# EAGLE schematic sd card copier (EAGLE 8.3.1)
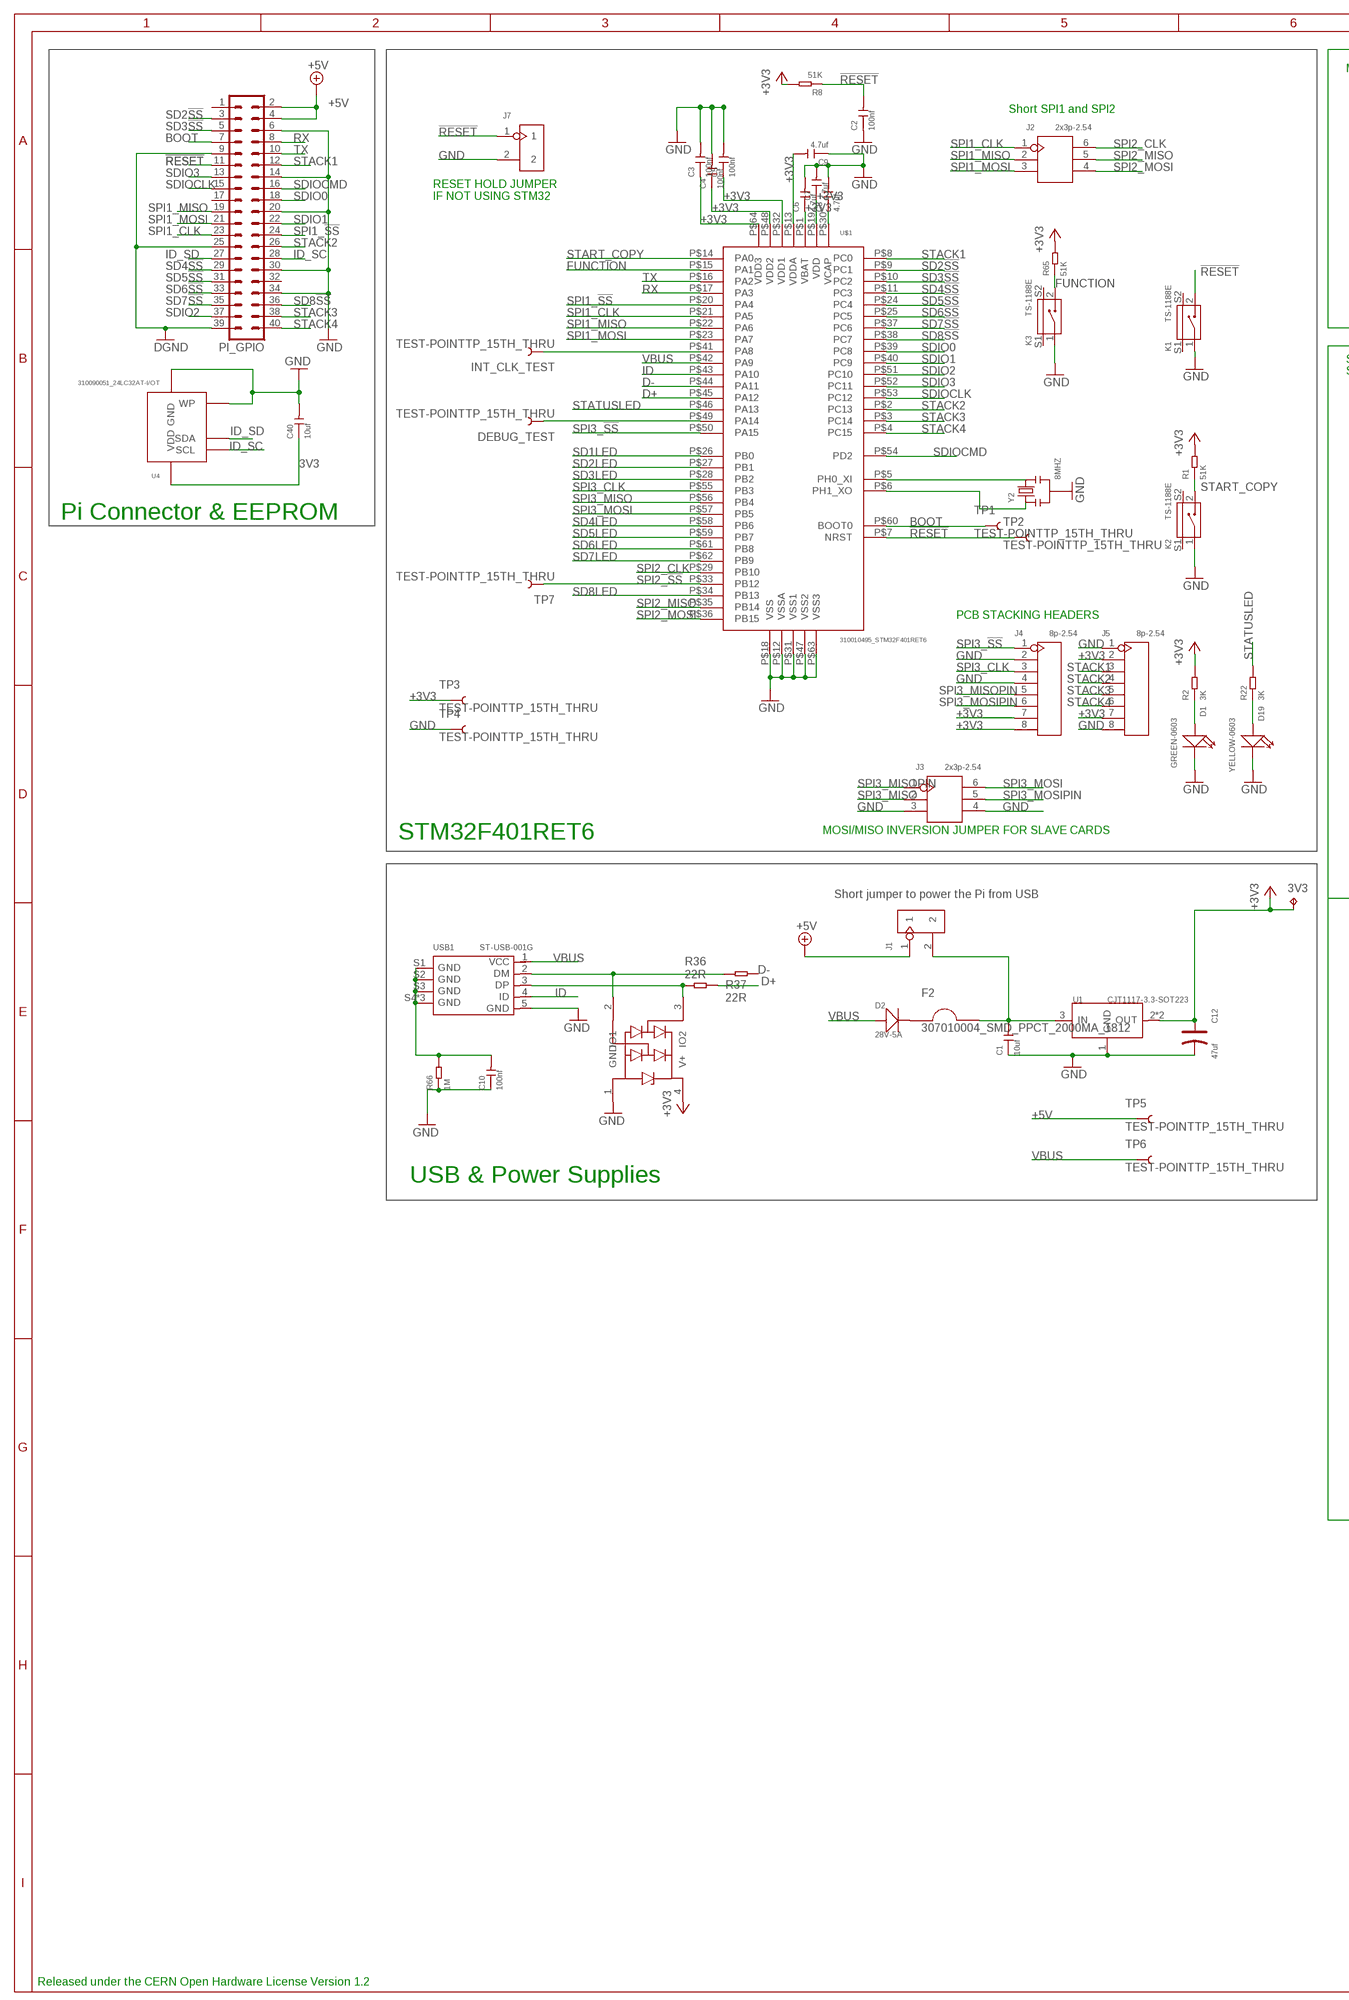
[diagram p0: schematic, sheet 1, part 1 of 2]
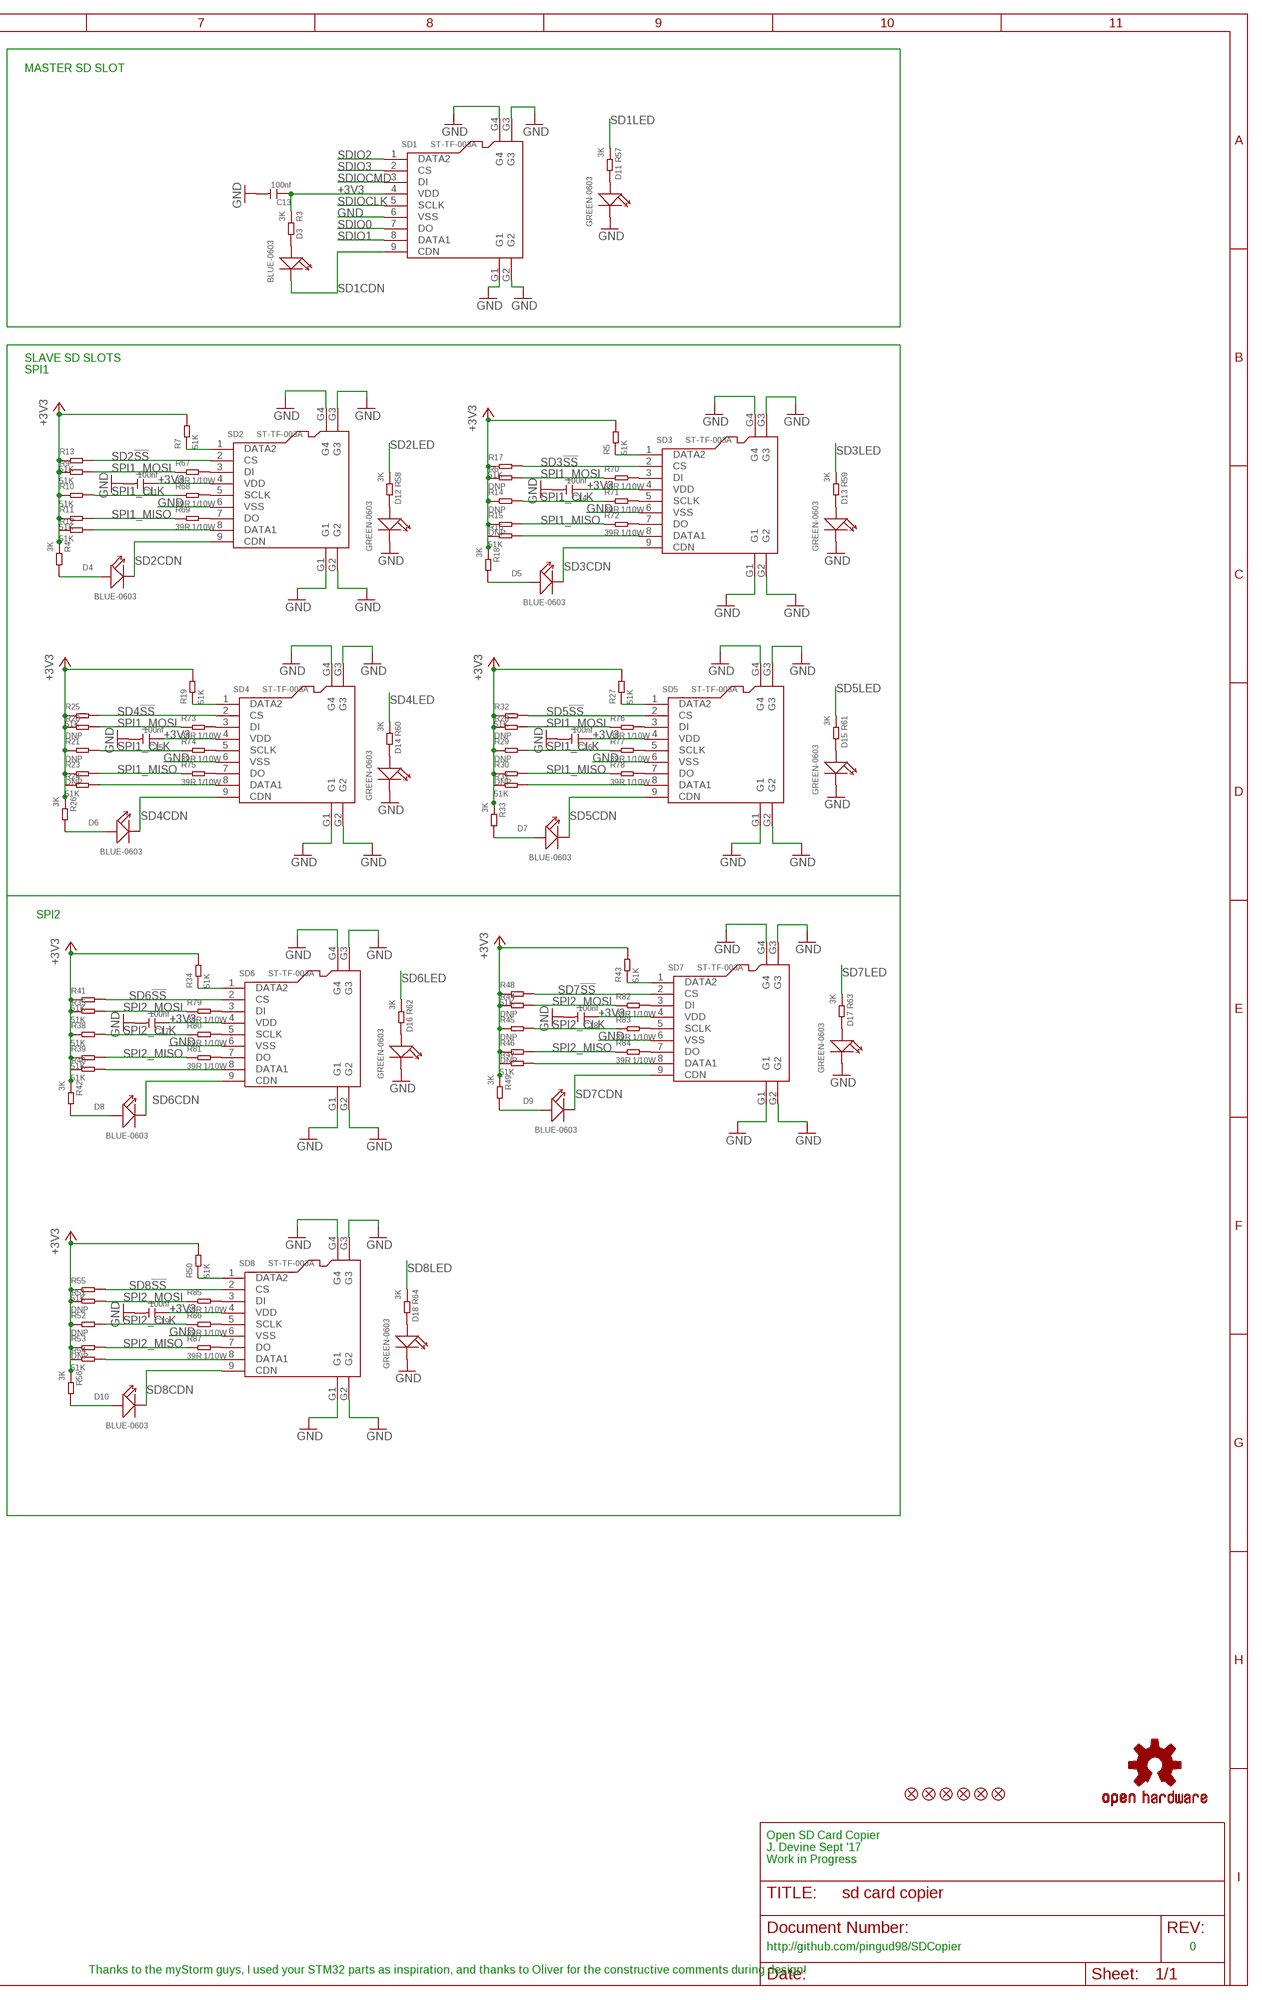
[diagram p1: schematic, sheet 1, part 2 of 2]

## Parts
3V3  TPB1,27  [B1,27]
C1  10uf  CERAMIC-10UF-10V-10%-X5R(0603)  [C0603]
C2  100nf  CERAMIC-100NF-50V-10%-X7R(0603)  [C0603]
C3  100nf  CERAMIC-100NF-50V-10%-X7R(0603)  [C0603]
C4  100nf  CERAMIC-100NF-50V-10%-X7R(0603)  [C0603]
C5  100nf  CERAMIC-100NF-50V-10%-X7R(0603)  [C0603]
C6  4.7uf  CERAMIC-4.7UF-10V-10%-X5R(0603)  [C0603]
C7  4.7uf  CERAMIC-4.7UF-10V-10%-X5R(0603)  [C0603]
C8  4.7uf  CERAMIC-4.7UF-10V-10%-X5R(0603)  [C0603]
C9  4.7uf  CERAMIC-4.7UF-10V-10%-X5R(0603)  [C0603]
C10  100nf  CERAMIC-100NF-50V-10%-X7R(0603)  [C0603]
C11  100nf  CERAMIC-100NF-50V-10%-X7R(0603)  [C0603]
C12  47uf  TANTALUM-SMD-47UF-6.3V(AVX-A)  [AVX-A]
C13  100nf  CERAMIC-100NF-50V-10%-X7R(0603)  [C0603]
C14  100nf  CERAMIC-100NF-50V-10%-X7R(0603)  [C0603]
C15  100nf  CERAMIC-100NF-50V-10%-X7R(0603)  [C0603]
C16  100nf  CERAMIC-100NF-50V-10%-X7R(0603)  [C0603]
C17  100nf  CERAMIC-100NF-50V-10%-X7R(0603)  [C0603]
C18  100nf  CERAMIC-100NF-50V-10%-X7R(0603)  [C0603]
C19  100nf  CERAMIC-100NF-50V-10%-X7R(0603)  [C0603]
C40  10uf  CERAMIC-10UF-10V-10%-X5R(0603)  [C0603]
D1  GREEN-0603  SMD-LED-CLEAR-GREEN(0603)  [LED-0603]
D2  28V-5A  SMD-DIODE-SCHOTTKY-28V-5A(DO-214AA)  [DO-214AA]
D3  BLUE-0603  SMD-LED-CLEAR-BLUE(0603)  [LED-0603]
D4  BLUE-0603  SMD-LED-CLEAR-BLUE(0603)  [LED-0603]
D5  BLUE-0603  SMD-LED-CLEAR-BLUE(0603)  [LED-0603]
D6  BLUE-0603  SMD-LED-CLEAR-BLUE(0603)  [LED-0603]
D7  BLUE-0603  SMD-LED-CLEAR-BLUE(0603)  [LED-0603]
D8  BLUE-0603  SMD-LED-CLEAR-BLUE(0603)  [LED-0603]
D9  BLUE-0603  SMD-LED-CLEAR-BLUE(0603)  [LED-0603]
D10  BLUE-0603  SMD-LED-CLEAR-BLUE(0603)  [LED-0603]
D11  GREEN-0603  SMD-LED-CLEAR-GREEN(0603)  [LED-0603]
D12  GREEN-0603  SMD-LED-CLEAR-GREEN(0603)  [LED-0603]
D13  GREEN-0603  SMD-LED-CLEAR-GREEN(0603)  [LED-0603]
D14  GREEN-0603  SMD-LED-CLEAR-GREEN(0603)  [LED-0603]
D15  GREEN-0603  SMD-LED-CLEAR-GREEN(0603)  [LED-0603]
D16  GREEN-0603  SMD-LED-CLEAR-GREEN(0603)  [LED-0603]
D17  GREEN-0603  SMD-LED-CLEAR-GREEN(0603)  [LED-0603]
D18  GREEN-0603  SMD-LED-CLEAR-GREEN(0603)  [LED-0603]
D19  YELLOW-0603  SMD-LED-CLEAR-YELLOW(0603)  [LED-0603]
DEBUG_TEST  TEST-POINTTP_15TH_THRU  [TP_15TH]
ESD1  PRTR5V0U2X  [SOT143B]
F2  307010004_SMD_PPCT_2000MA_1812  [F1812]
FD1  FIDUCIAL1X2  [FIDUCIAL-1X2]
FD2  FIDUCIAL1X2  [FIDUCIAL-1X2]
FD3  FIDUCIAL1X2  [FIDUCIAL-1X2]
FD4  FIDUCIAL1X2  [FIDUCIAL-1X2]
FD5  FIDUCIAL1X2  [FIDUCIAL-1X2]
FD6  FIDUCIAL1X2  [FIDUCIAL-1X2]
INT_CLK_TEST  TEST-POINTTP_15TH_THRU  [TP_15TH]
J1  DIP-BLACK-JUMPER  [H2-2.54]
J2  2x3p-2.54  DIP-BLACK-MALE-HEADER(2X3P-2.54）-2.54  [H2X3-2.54]
J3  2x3p-2.54  DIP-BLACK-MALE-HEADER(2X3P-2.54）-2.54  [H2X3-2.54]
J4  8p-2.54  DIP-LONG-BLACK-FEMALE-HEADER-VERT(8P-2.54)  [H8-2.54]
J5  8p-2.54  DIP-LONG-BLACK-FEMALE-HEADER-VERT(8P-2.54)  [H8-2.54]
J7  DIP-BLACK-JUMPER  [H2-2.54]
K1  TS-1188E  SMD-BUTTON(2+2P-7X3.5MM-90D)  [SW4-SMD-7.0X3.5X3.5MM-90D]
K2  TS-1188E  SMD-BUTTON(2+2P-7X3.5MM-90D)  [SW4-SMD-7.0X3.5X3.5MM-90D]
K3  TS-1188E  SMD-BUTTON(2+2P-7X3.5MM-90D)  [SW4-SMD-7.0X3.5X3.5MM-90D]
OSHW  OSHW-LOGOL  [OSHW-LOGO-L]
PI_GPIO  MA20-2  [MA20-2]
R1  51K  SMD-RES-51K-5%-1/10W(0603)  [R0603]
R2  3K  SMD-RES-3K-1%-1/10W(0603)  [R0603]
R3  3K  SMD-RES-3K-1%-1/10W(0603)  [R0603]
R4  3K  SMD-RES-3K-1%-1/10W(0603)  [R0603]
R5  51K  SMD-RES-51K-5%-1/10W(0603)  [R0603]
R6  DNP  SMD-RES-51K-5%-1/10W(0603)  [R0603]
R7  51K  SMD-RES-51K-5%-1/10W(0603)  [R0603]
R8  51K  SMD-RES-51K-5%-1/10W(0603)  [R0603]
R9  51K  SMD-RES-51K-5%-1/10W(0603)  [R0603]
R10  51K  SMD-RES-51K-5%-1/10W(0603)  [R0603]
R11  51K  SMD-RES-51K-5%-1/10W(0603)  [R0603]
R12  51K  SMD-RES-51K-5%-1/10W(0603)  [R0603]
R13  51K  SMD-RES-51K-5%-1/10W(0603)  [R0603]
R14  DNP  SMD-RES-51K-5%-1/10W(0603)  [R0603]
R15  DNP  SMD-RES-51K-5%-1/10W(0603)  [R0603]
R16  51K  SMD-RES-51K-5%-1/10W(0603)  [R0603]
R17  51K  SMD-RES-51K-5%-1/10W(0603)  [R0603]
R18  3K  SMD-RES-3K-1%-1/10W(0603)  [R0603]
R19  51K  SMD-RES-51K-5%-1/10W(0603)  [R0603]
R20  DNP  SMD-RES-51K-5%-1/10W(0603)  [R0603]
R21  DNP  SMD-RES-51K-5%-1/10W(0603)  [R0603]
R22  3K  SMD-RES-3K-1%-1/10W(0603)  [R0603]
R23  DNP  SMD-RES-51K-5%-1/10W(0603)  [R0603]
R24  51K  SMD-RES-51K-5%-1/10W(0603)  [R0603]
R25  51K  SMD-RES-51K-5%-1/10W(0603)  [R0603]
R26  3K  SMD-RES-3K-1%-1/10W(0603)  [R0603]
R27  51K  SMD-RES-51K-5%-1/10W(0603)  [R0603]
R28  DNP  SMD-RES-51K-5%-1/10W(0603)  [R0603]
R29  DNP  SMD-RES-51K-5%-1/10W(0603)  [R0603]
R30  DNP  SMD-RES-51K-5%-1/10W(0603)  [R0603]
R31  51K  SMD-RES-51K-5%-1/10W(0603)  [R0603]
R32  51K  SMD-RES-51K-5%-1/10W(0603)  [R0603]
R33  3K  SMD-RES-3K-1%-1/10W(0603)  [R0603]
R34  51K  SMD-RES-51K-5%-1/10W(0603)  [R0603]
R35  51K  SMD-RES-51K-5%-1/10W(0603)  [R0603]
R36  22R  SMD-RES-22R-5%-1/10W(0603)  [R0603]
R37  22R  SMD-RES-22R-5%-1/10W(0603)  [R0603]
R38  51K  SMD-RES-51K-5%-1/10W(0603)  [R0603]
R39  51K  SMD-RES-51K-5%-1/10W(0603)  [R0603]
R40  51K  SMD-RES-51K-5%-1/10W(0603)  [R0603]
R41  51K  SMD-RES-51K-5%-1/10W(0603)  [R0603]
R42  3K  SMD-RES-3K-1%-1/10W(0603)  [R0603]
R43  51K  SMD-RES-51K-5%-1/10W(0603)  [R0603]
R44  DNP  SMD-RES-51K-5%-1/10W(0603)  [R0603]
R45  DNP  SMD-RES-51K-5%-1/10W(0603)  [R0603]
R46  DNP  SMD-RES-51K-5%-1/10W(0603)  [R0603]
R47  51K  SMD-RES-51K-5%-1/10W(0603)  [R0603]
R48  51K  SMD-RES-51K-5%-1/10W(0603)  [R0603]
R49  3K  SMD-RES-3K-1%-1/10W(0603)  [R0603]
R50  51K  SMD-RES-51K-5%-1/10W(0603)  [R0603]
R51  DNP  SMD-RES-51K-5%-1/10W(0603)  [R0603]
R52  DNP  SMD-RES-51K-5%-1/10W(0603)  [R0603]
R53  DNP  SMD-RES-51K-5%-1/10W(0603)  [R0603]
R54  51K  SMD-RES-51K-5%-1/10W(0603)  [R0603]
R55  51K  SMD-RES-51K-5%-1/10W(0603)  [R0603]
R56  3K  SMD-RES-3K-1%-1/10W(0603)  [R0603]
R57  3K  SMD-RES-3K-1%-1/10W(0603)  [R0603]
R58  3K  SMD-RES-3K-1%-1/10W(0603)  [R0603]
R59  3K  SMD-RES-3K-1%-1/10W(0603)  [R0603]
R60  3K  SMD-RES-3K-1%-1/10W(0603)  [R0603]
R61  3K  SMD-RES-3K-1%-1/10W(0603)  [R0603]
R62  3K  SMD-RES-3K-1%-1/10W(0603)  [R0603]
R63  3K  SMD-RES-3K-1%-1/10W(0603)  [R0603]
R64  3K  SMD-RES-3K-1%-1/10W(0603)  [R0603]
R65  51K  SMD-RES-51K-5%-1/10W(0603)  [R0603]
R66  1M  SMD-RES-1M-1%-1/10W(0603)  [R0603]
R67  39R 1/10W  SMD-RES-39R-5%-1/10W(0603)  [R0603]
R68  39R 1/10W  SMD-RES-39R-5%-1/10W(0603)  [R0603]
R69  39R 1/10W  SMD-RES-39R-5%-1/10W(0603)  [R0603]
R70  39R 1/10W  SMD-RES-39R-5%-1/10W(0603)  [R0603]
R71  39R 1/10W  SMD-RES-39R-5%-1/10W(0603)  [R0603]
R72  39R 1/10W  SMD-RES-39R-5%-1/10W(0603)  [R0603]
R73  39R 1/10W  SMD-RES-39R-5%-1/10W(0603)  [R0603]
R74  39R 1/10W  SMD-RES-39R-5%-1/10W(0603)  [R0603]
R75  39R 1/10W  SMD-RES-39R-5%-1/10W(0603)  [R0603]
R76  39R 1/10W  SMD-RES-39R-5%-1/10W(0603)  [R0603]
R77  39R 1/10W  SMD-RES-39R-5%-1/10W(0603)  [R0603]
R78  39R 1/10W  SMD-RES-39R-5%-1/10W(0603)  [R0603]
R79  39R 1/10W  SMD-RES-39R-5%-1/10W(0603)  [R0603]
R80  39R 1/10W  SMD-RES-39R-5%-1/10W(0603)  [R0603]
R81  39R 1/10W  SMD-RES-39R-5%-1/10W(0603)  [R0603]
R82  39R 1/10W  SMD-RES-39R-5%-1/10W(0603)  [R0603]
R83  39R 1/10W  SMD-RES-39R-5%-1/10W(0603)  [R0603]
R84  39R 1/10W  SMD-RES-39R-5%-1/10W(0603)  [R0603]
R85  39R 1/10W  SMD-RES-39R-5%-1/10W(0603)  [R0603]
R86  39R 1/10W  SMD-RES-39R-5%-1/10W(0603)  [R0603]
R87  39R 1/10W  SMD-RES-39R-5%-1/10W(0603)  [R0603]
SD1  ST-TF-003A  MICRO-SD-CARD-SOCKET-9P(ST-TF-003A)  [MICRO-SD9+4P-SMD-16.1X14.5X1.85MM]
SD2  ST-TF-003A  MICRO-SD-CARD-SOCKET-9P(ST-TF-003A)  [MICRO-SD9+4P-SMD-16.1X14.5X1.85MM]
SD3  ST-TF-003A  MICRO-SD-CARD-SOCKET-9P(ST-TF-003A)  [MICRO-SD9+4P-SMD-16.1X14.5X1.85MM]
SD4  ST-TF-003A  MICRO-SD-CARD-SOCKET-9P(ST-TF-003A)  [MICRO-SD9+4P-SMD-16.1X14.5X1.85MM]
SD5  ST-TF-003A  MICRO-SD-CARD-SOCKET-9P(ST-TF-003A)  [MICRO-SD9+4P-SMD-16.1X14.5X1.85MM]
SD6  ST-TF-003A  MICRO-SD-CARD-SOCKET-9P(ST-TF-003A)  [MICRO-SD9+4P-SMD-16.1X14.5X1.85MM]
SD7  ST-TF-003A  MICRO-SD-CARD-SOCKET-9P(ST-TF-003A)  [MICRO-SD9+4P-SMD-16.1X14.5X1.85MM]
SD8  ST-TF-003A  MICRO-SD-CARD-SOCKET-9P(ST-TF-003A)  [MICRO-SD9+4P-SMD-16.1X14.5X1.85MM]
TP1  TEST-POINTTP_15TH_THRU  [TP_15TH]
TP2  TEST-POINTTP_15TH_THRU  [TP_15TH]
TP3  TEST-POINTTP_15TH_THRU  [TP_15TH]
TP4  TEST-POINTTP_15TH_THRU  [TP_15TH]
TP5  TEST-POINTTP_15TH_THRU  [TP_15TH]
TP6  TEST-POINTTP_15TH_THRU  [TP_15TH]
TP7  TEST-POINTTP_15TH_THRU  [TP_15TH]
U1  CJT1117-3.3-SOT223  PMIC-CJT1117-3.3(SOT223)  [SOT-223]
U4  310090051_24LC32AT-I/OT  [SOT235]
U$1  310010495_STM32F401RET6  [LQFP64]
USB1  ST-USB-001G  MICRO-USB-SMD-B-WITHOUT-POST-W/P(ST-USB-001G)  [MICRO-USB5+4P-SMD-0.65-B]
Y2  8MHZ  SMD-RESONATOR-8MHZ-33PF-0.1%(3P-3.2X1.3MM)  [X3-SMD-3.6X1.3X0.8MM]

## Nets
3V3: C40.1 U4.4(VDD)
!RESET: C2.2 J7.1 K1.2 PI_GPIO.11 R8.1 TP2.P$1 U$1.P$7(NRST)
+3V3: 3V3.TP C3.1 C4.1 C5.1 C6.1 C7.1 C9.2 C11.1 C12.+ C13.1 C14.1 C15.1 C16.1 C17.1 C18.1 C19.1 ESD1.4(V+) J4.7 J4.8 J5.2 J5.7 R1.2 R2.2 R3.1 R4.1 R5.2 R6.1 R7.2 R8.2 R9.1 R10.1 R11.1 R12.1 R13.1 R14.1 R15.1 R16.1 R17.1 R18.1 R19.2 R20.1 R21.1 R23.1 R24.1 R25.1 R26.1 R27.2 R28.1 R29.1 R30.1 R31.1 R32.1 R33.1 R34.2 R35.1 R38.1 R39.1 R40.1 R41.1 R42.1 R43.2 R44.1 R45.1 R46.1 R47.1 R48.1 R49.1 R50.2 R51.1 R52.1 R53.1 R54.1 R55.1 R56.1 R65.2 SD1.4(VDD) SD2.4(VDD) SD3.4(VDD) SD4.4(VDD) SD5.4(VDD) SD6.4(VDD) SD7.4(VDD) SD8.4(VDD) TP3.P$1 U1.2(OUT) U1.TER(OUT) U$1.P$1(VBAT) U$1.P$13(VDDA) U$1.P$19(VDD) U$1.P$32(VDD1) U$1.P$48(VDD2) U$1.P$64(VDD3)
+5V: J1.1 PI_GPIO.2 PI_GPIO.4 TP5.P$1
BOOT: PI_GPIO.7 TP1.P$1 U$1.P$60(BOOT0)
D+: R36.1 U$1.P$45(PA12)
D-: R37.1 U$1.P$44(PA11)
FUNCTION: K3.2 R65.1 U$1.P$15(PA1)
GND: C1.1 C2.1 C3.2 C4.2 C5.2 C6.2 C7.2 C8.2 C9.1 C10.1 C11.2 C12.- C13.2 C14.2 C15.2 C16.2 C17.2 C18.2 C19.2 C40.2 D1.- D11.- D12.- D13.- D14.- D15.- D16.- D17.- D18.- D19.- ESD1.1(GND) J3.3 J3.4 J4.2 J4.4 J5.1 J5.8 J7.2 K1.1 K2.1 K3.1 PI_GPIO.6 PI_GPIO.9 PI_GPIO.14 PI_GPIO.20 PI_GPIO.25 PI_GPIO.30 PI_GPIO.34 PI_GPIO.39 R66.1 SD1.6(VSS) SD1.G1 SD1.G2 SD1.G3 SD1.G4 SD2.6(VSS) SD2.G1 SD2.G2 SD2.G3 SD2.G4 SD3.6(VSS) SD3.G1 SD3.G2 SD3.G3 SD3.G4 SD4.6(VSS) SD4.G1 SD4.G2 SD4.G3 SD4.G4 SD5.6(VSS) SD5.G1 SD5.G2 SD5.G3 SD5.G4 SD6.6(VSS) SD6.G1 SD6.G2 SD6.G3 SD6.G4 SD7.6(VSS) SD7.G1 SD7.G2 SD7.G3 SD7.G4 SD8.6(VSS) SD8.G1 SD8.G2 SD8.G3 SD8.G4 TP4.P$1 U1.1(GND) U4.2(GND) U4.5(WP) U$1.P$12(VSSA) U$1.P$18(VSS) U$1.P$31(VSS1) U$1.P$47(VSS2) U$1.P$63(VSS3) USB1.5(GND) Y2.2 ; supply symbol labelled DGND
ID: U$1.P$43(PA10) USB1.4(ID)
ID_SC: PI_GPIO.28 U4.1(SCL)
ID_SD: PI_GPIO.27 U4.3(SDA)
N$1: D1.+ R2.1
N$2: D2.- F2.P$1
N$3: C8.1 U$1.P$30(VCAP)
N$4: C10.2 R66.2 USB1.S1(GND) USB1.S2(GND) USB1.S3(GND) USB1.S4(GND) USB1.S5(GND) USB1.S6(GND)
N$5: ESD1.3(IO2) R36.2 USB1.3(DP)
N$6: ESD1.2(IO1) R37.2 USB1.2(DM)
N$7: U$1.P$5(PH0_XI) Y2.3
N$9: C1.2 F2.P$2 J1.2 U1.3(IN)
N$10: D4.+ R4.2
N$11: D3.+ R3.2
N$12: R16.2 SD3.8(DATA1)
N$13: R5.1 SD3.1(DATA2)
N$15: D5.+ R18.2
N$17: R24.2 SD4.8(DATA1)
N$19: U$1.P$6(PH1_XO) Y2.1
N$20: R12.2 SD2.8(DATA1)
N$21: R19.1 SD4.1(DATA2)
N$22: R7.1 SD2.1(DATA2)
N$23: D6.+ R26.2
N$24: R31.2 SD5.8(DATA1)
N$25: R27.1 SD5.1(DATA2)
N$26: D7.+ R33.2
N$27: R43.1 SD7.1(DATA2)
N$28: R34.1 SD6.1(DATA2)
N$29: D8.+ R42.2
N$30: D9.+ R49.2
N$31: R47.2 SD7.8(DATA1)
N$32: R50.1 SD8.1(DATA2)
N$33: R40.2 SD6.8(DATA1)
N$34: D10.+ R56.2
N$35: R54.2 SD8.8(DATA1)
N$36: D11.+ R57.2
N$38: D12.+ R58.2
N$40: D13.+ R59.2
N$42: D14.+ R60.2
N$44: D15.+ R61.2
N$46: D16.+ R62.2
N$48: D17.+ R63.2
N$50: D18.+ R64.2
N$56: D19.+ R22.1
N$57: R67.2 SD2.3(DI)
N$58: R68.2 SD2.5(SCLK)
N$59: R69.2 SD2.7(DO)
N$60: R70.2 SD3.3(DI)
N$61: R71.2 SD3.5(SCLK)
N$62: R72.2 SD3.7(DO)
N$63: R73.2 SD4.3(DI)
N$64: R74.2 SD4.5(SCLK)
N$65: R75.2 SD4.7(DO)
N$66: R76.2 SD5.3(DI)
N$67: R77.2 SD5.5(SCLK)
N$68: R78.2 SD5.7(DO)
N$69: R79.2 SD6.3(DI)
N$70: R80.2 SD6.5(SCLK)
N$71: R81.2 SD6.7(DO)
N$72: R82.2 SD7.3(DI)
N$73: R83.2 SD7.5(SCLK)
N$74: R84.2 SD7.7(DO)
N$75: R85.2 SD8.3(DI)
N$76: R86.2 SD8.5(SCLK)
N$77: R87.2 SD8.7(DO)
N$99: INT_CLK_TEST.P$1 U$1.P$41(PA8)
N$100: DEBUG_TEST.P$1 U$1.P$49(PA14)
RX: PI_GPIO.8 U$1.P$17(PA3)
SD1CDN: D3.- SD1.9(CDN)
SD1LED: R57.1 U$1.P$26(PB0)
SD2!SS: PI_GPIO.3 R13.2 SD2.2(CS) U$1.P$9(PC1)
SD2CDN: D4.- SD2.9(CDN)
SD2LED: R58.1 U$1.P$27(PB1)
SD3!SS: PI_GPIO.5 R17.2 SD3.2(CS) U$1.P$10(PC2)
SD3CDN: D5.- SD3.9(CDN)
SD3LED: R59.1 U$1.P$28(PB2)
SD4!SS: PI_GPIO.29 R25.2 SD4.2(CS) U$1.P$11(PC3)
SD4CDN: D6.- SD4.9(CDN)
SD4LED: R60.1 U$1.P$58(PB6)
SD5!SS: PI_GPIO.31 R32.2 SD5.2(CS) U$1.P$24(PC4)
SD5CDN: D7.- SD5.9(CDN)
SD5LED: R61.1 U$1.P$59(PB7)
SD6!SS: PI_GPIO.33 R41.2 SD6.2(CS) U$1.P$25(PC5)
SD6CDN: D8.- SD6.9(CDN)
SD6LED: R62.1 U$1.P$61(PB8)
SD7!SS: PI_GPIO.35 R48.2 SD7.2(CS) U$1.P$37(PC6)
SD7CDN: D9.- SD7.9(CDN)
SD7LED: R63.1 U$1.P$62(PB9)
SD8!SS: PI_GPIO.36 R55.2 SD8.2(CS) U$1.P$38(PC7)
SD8CDN: D10.- SD8.9(CDN)
SD8LED: R64.1 U$1.P$34(PB13)
SDIO0: PI_GPIO.18 SD1.7(DO) U$1.P$39(PC8)
SDIO1: PI_GPIO.22 SD1.8(DATA1) U$1.P$40(PC9)
SDIO2: PI_GPIO.37 SD1.1(DATA2) U$1.P$51(PC10)
SDIO3: PI_GPIO.13 SD1.2(CS) U$1.P$52(PC11)
SDIOCLK: PI_GPIO.15 SD1.5(SCLK) U$1.P$53(PC12)
SDIOCMD: PI_GPIO.16 SD1.3(DI) U$1.P$54(PD2)
SPI1_!SS: PI_GPIO.24 U$1.P$20(PA4)
SPI1_CLK: J2.1 PI_GPIO.23 R10.2 R14.2 R21.2 R29.2 R68.1 R71.1 R74.1 R77.1 U$1.P$21(PA5)
SPI1_MISO: J2.2 PI_GPIO.19 R11.2 R15.2 R23.2 R30.2 R69.1 R72.1 R75.1 R78.1 U$1.P$22(PA6)
SPI1_MOSI: J2.3 PI_GPIO.21 R6.2 R9.2 R20.2 R28.2 R67.1 R70.1 R73.1 R76.1 U$1.P$23(PA7)
SPI2_!SS: TP7.P$1 U$1.P$33(PB12)
SPI2_CLK: J2.6 R38.2 R45.2 R52.2 R80.1 R83.1 R86.1 U$1.P$29(PB10)
SPI2_MISO: J2.5 R39.2 R46.2 R53.2 R81.1 R84.1 R87.1 U$1.P$35(PB14)
SPI2_MOSI: J2.4 R35.2 R44.2 R51.2 R79.1 R82.1 R85.1 U$1.P$36(PB15)
SPI3_!SS: J4.1 U$1.P$50(PA15)
SPI3_CLK: J4.3 U$1.P$55(PB3)
SPI3_MISO: J3.2 U$1.P$56(PB4)
SPI3_MISOPIN: J3.1 J4.5
SPI3_MOSI: J3.6 U$1.P$57(PB5)
SPI3_MOSIPIN: J3.5 J4.6
STACK1: J5.3 PI_GPIO.12 U$1.P$8(PC0)
STACK2: J5.4 PI_GPIO.26 U$1.P$2(PC13)
STACK3: J5.5 PI_GPIO.38 U$1.P$3(PC14)
STACK4: J5.6 PI_GPIO.40 U$1.P$4(PC15)
START_COPY: K2.2 R1.1 U$1.P$14(PA0)
STATUSLED: R22.2 U$1.P$46(PA13)
TX: PI_GPIO.10 U$1.P$16(PA2)
VBUS: D2.+ TP6.P$1 U$1.P$42(PA9) USB1.1(VCC)
Unconnected: K1.S1 K1.S2 K2.S1 K2.S2 K3.S1 K3.S2 PI_GPIO.1 PI_GPIO.17 PI_GPIO.32

## Notes on the sheet
- MASTER SD SLOT
- Short SPI1 and SPI2
- RESET HOLD JUMPER
  IF NOT USING STM32
- SLAVE SD SLOTS
- SPI1
- Pi Connector & EEPROM
- PCB STACKING HEADERS
- MOSI/MISO INVERSION JUMPER FOR SLAVE CARDS
- STM32F401RET6
- Short jumper to power the Pi from USB
- SPI2
- USB & Power Supplies
- Open SD Card Copier
  J. Devine Sept '17
  Work in Progress
- http://github.com/pingud98/SDCopier | 0
- Thanks to the myStorm guys, I used your STM32 parts as inspiration, and thanks to Oliver for the constructive comments during design!
- Released under the CERN Open Hardware License Version 1.2

## Library data of the parts
3V3 = testpad:TP: Test pad
C1 C40 = Seeed-Capacitor:CERAMIC-10UF-10V-10%-X5R(0603): 302010103; MPN: CC0603KRX5R6BB106
C2-C5 C10 C11 C13-C19 = Seeed-Capacitor:CERAMIC-100NF-50V-10%-X7R(0603): 302010138; MPN: CC0603KRX7R9BB104
C6-C9 = Seeed-Capacitor:CERAMIC-4.7UF-10V-10%-X5R(0603): 302010111; MPN: CC0603KRX5R6BB475
C12 = Seeed-Capacitor:TANTALUM-SMD-47UF-6.3V(AVX-A): 302020005; MPN: TAJA476*006#NJ
D1 D11-D18 = Seeed-LED:SMD-LED-CLEAR-GREEN(0603): 304090043; MPN: 19-217-G7C-AN1P2-3T
D2 = Seeed-OPL-2017-01-Diode-james:SMD-DIODE-SCHOTTKY-28V-5A(DO-214AA): 304020021; MPN: SS54B
D3-D10 = Seeed-LED:SMD-LED-CLEAR-BLUE(0603): 304090045; MPN: 19-217-BHC-ZL1M2RY-3T
D19 = Seeed-LED:SMD-LED-CLEAR-YELLOW(0603): 304090044; MPN: 19-217-Y5C-AM1N1VY-3T
DEBUG_TEST INT_CLK_TEST TP1-TP7 = SparkFun-Connectors:TEST-POINT: SparkFun Test Points Bare copper test points for troubleshooting or In-Circuit-Testing. These are used by our Production team for verifying production board runs using pogo-pins on test beds. SparkFun Products: SparkFun LSM9DS1 Breakout <https://www.sparkfun.com/products/13284> SparkFun PSOC <https://www.sparkfun.com/products/13714> SparkFun Load Cell Amplifier <https://www.sparkfun.com/products/13879>
ESD1 = amino:PRTR5V0U2X
F2 = Seeed-OPL-2017-01-Fuse-Akita:307010004_SMD_PPCT_2000MA_1812: SMD PPCT-2000mA;1812, 2A-16V, SKU: 307010004
FD1-FD6 = SparkFun-Aesthetics:FIDUCIAL: Fiducial Alignment Points Point-of-reference for pick-and-place machines and other optical instruments.
J1 J7 = Seeed-Connector:DIP-BLACK-JUMPER: 320190003
J2 J3 = Seeed-Connector:DIP-BLACK-MALE-HEADER(2X3P-2.54）: 320020077; MPN: P125-12A1BS116A1
J4 J5 = Seeed-Connector:DIP-LONG-BLACK-FEMALE-HEADER-VERT(8P-2.54): 320030013; MPN: F185-2108A1BSYA1
K1-K3 = Seeed-Switch:SMD-BUTTON(2+2P-7X3.5MM-90D): 311020023; MPN: TS-1188E
OSHW = SparkFun:OSHW-LOGO: Open Source Hardware Logo This logo indicates the piece of hardware it is found on incorporates a OSHW license and/or adheres to the definition of open source hardware found here: http://freedomdefined.org/OSHW
PI_GPIO = con-lstb:MA20-2: PIN HEADER; OC_FARNELL: unknown; OC_NEWARK: unknown
R1 R5 R7-R13 R16 R17 R19 R24 R25 R27 R31 R32 R34 R35 R38-R41 R43 R47 R48 R50 R54 R55 R65 = Seeed-Resistor:SMD-RES-51K-5%-1/10W(0603): 301010145; MPN: RC0603JR-0751KL
R2-R4 R18 R22 R26 R33 R42 R49 R56-R64 = Seeed-Resistor:SMD-RES-3K-1%-1/10W(0603): 301010170; MPN: RC0603FR-073KL
R6 R14 R15 R20 R21 R23 R28-R30 R44-R46 R51-R53 = Seeed-Resistor:SMD-RES-51K-5%-1/10W(0603): 301010145; MPN: RC0603JR-0751KL; VALUE: 51K
R36 R37 = Seeed-Resistor:SMD-RES-22R-5%-1/10W(0603): 301010289; MPN: RC0603JR-0722RL
R66 = Seeed-Resistor:SMD-RES-1M-1%-1/10W(0603): 301010151; MPN: RC0603FR-071ML
R67-R87 = Seeed-Resistor:SMD-RES-39R-5%-1/10W(0603): 301010138; MPN: RC0603JR-0739RL
SD1-SD8 = Seeed-Connector:MICRO-SD-CARD-SOCKET-9P(ST-TF-003A): 320090000; MPN: ST-TF-003A
U1 = Seeed-IC:PMIC-CJT1117-3.3(SOT223): 310030097; MPN: CJT1117-3.3
U4 = Seeed-OPL-2017-01-IC-Akita:310090051_24LC32AT-I/OT: Microchip;24LC32AT-I/OT, SMD IC Memory;SOT-23-5, SKU: 310090051
U$1 = Seeed-OPL-2017-01-IC-Akita:310010495_STM32F401RET6: ST;STM32F401RET6, SMD IC MCU;LQFP-64, SKU: 310010495
USB1 = Seeed-Connector:MICRO-USB-SMD-B-WITHOUT-POST-W/P(ST-USB-001G): 320010000; MPN: ST-USB-001G
Y2 = Seeed-Crystal Oscillator:SMD-RESONATOR-8MHZ-33PF-0.1%(3P-3.2X1.3MM): 306030005; MPN: CSTCE8M00G15L99-R0

## Net classes
2 thin_power: width 0.254 mm